# Altium schematic sheet Top-level.SchDoc: =Project + Document
size A4; SheetNumber: 1; SheetTotal: SheetTotaal; Document: Top-level
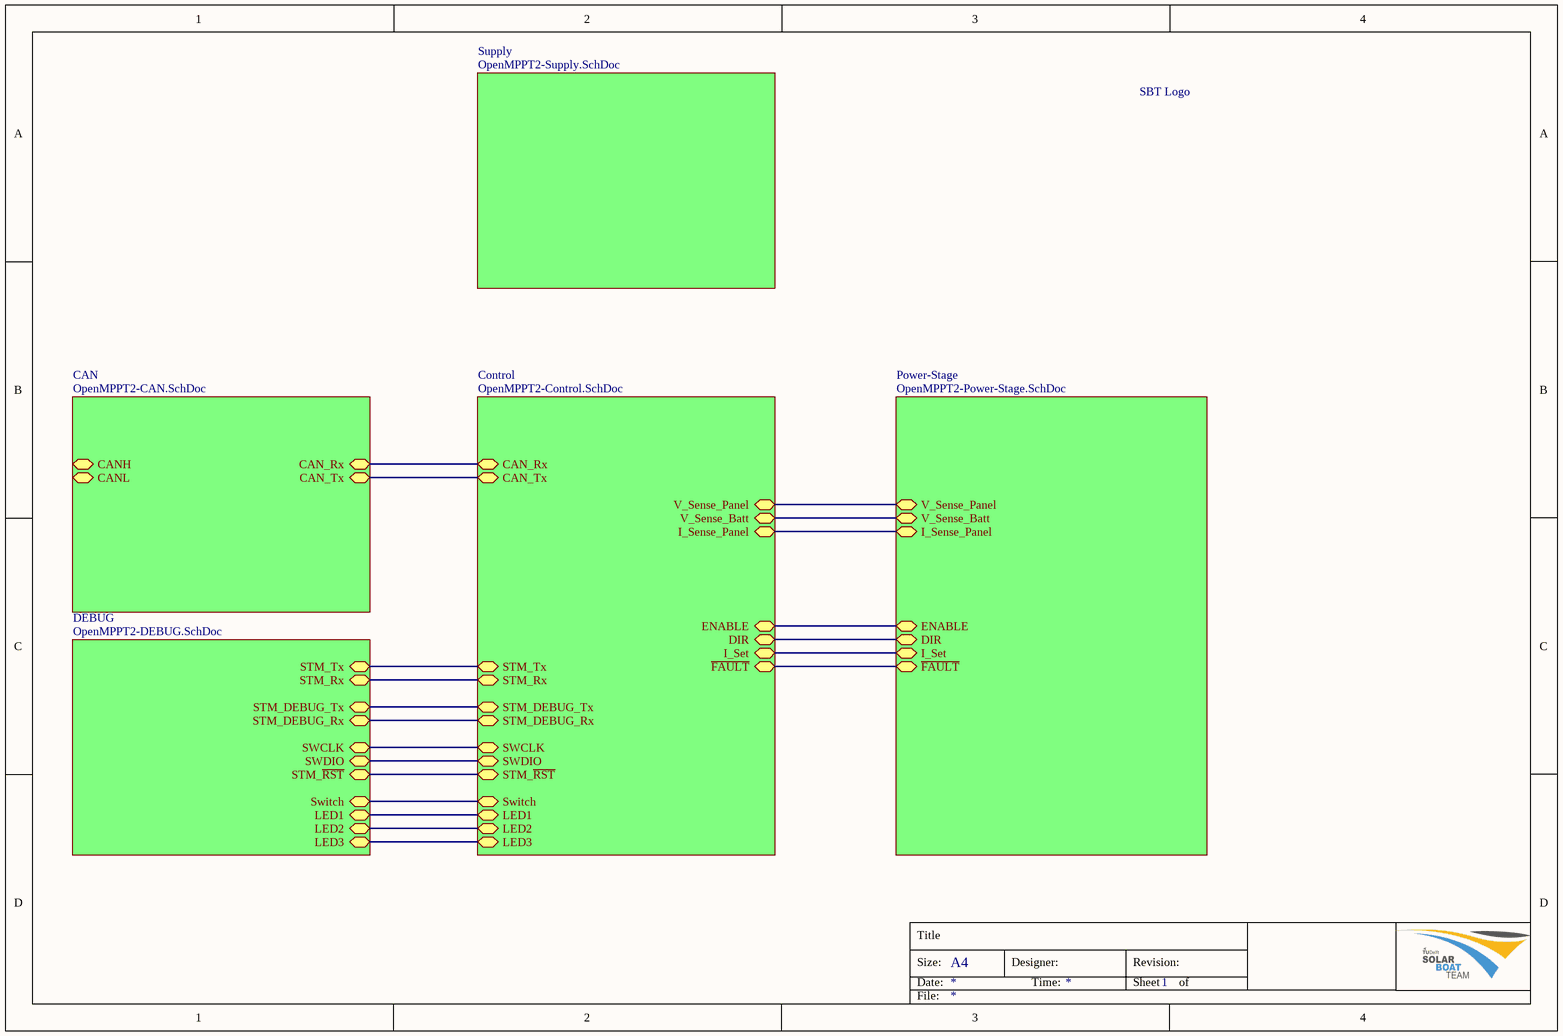
[diagram p0: Top-level.SchDoc]

## Parts
Logo1  SBT Logo  [SBT Logo 1000x]  (value not drawn)

## Sub-sheets
CAN = OpenMPPT2-CAN.SchDoc: CAN_Rx, CAN_Tx, CANH, CANL
Control = OpenMPPT2-Control.SchDoc: STM_~{RST}, SWCLK, SWDIO, STM_Rx, STM_Tx, STM_DEBUG_Rx, STM_DEBUG_Tx, CAN_Rx, CAN_Tx, LED1, LED2, Switch, V_Sense_Panel, I_Set, V_Sense_Batt, I_Sense_Panel, ENABLE, DIR, ~{FAULT}, LED3
DEBUG = OpenMPPT2-DEBUG.SchDoc: STM_~{RST}, SWCLK, SWDIO, STM_Rx, STM_Tx, STM_DEBUG_Tx, STM_DEBUG_Rx, LED1, LED2, Switch, LED3
Power-Stage = OpenMPPT2-Power-Stage.SchDoc: V_Sense_Panel, I_Set, V_Sense_Batt, I_Sense_Panel, ENABLE, DIR, ~{FAULT}
Supply = OpenMPPT2-Supply.SchDoc: no entries

## Nets
(unnamed): sheet Control/STM_~{RST}, sheet DEBUG/STM_~{RST}
(unnamed): sheet Control/SWCLK, sheet DEBUG/SWCLK
(unnamed): sheet Control/SWDIO, sheet DEBUG/SWDIO
(unnamed): sheet Control/STM_Rx, sheet DEBUG/STM_Rx
(unnamed): sheet Control/STM_Tx, sheet DEBUG/STM_Tx
(unnamed): sheet Control/STM_DEBUG_Rx, sheet DEBUG/STM_DEBUG_Rx
(unnamed): sheet Control/STM_DEBUG_Tx, sheet DEBUG/STM_DEBUG_Tx
(unnamed): sheet Control/CAN_Rx, sheet CAN/CAN_Rx
(unnamed): sheet Control/CAN_Tx, sheet CAN/CAN_Tx
(unnamed): sheet Control/LED1, sheet DEBUG/LED1
(unnamed): sheet Control/LED2, sheet DEBUG/LED2
(unnamed): sheet Control/Switch, sheet DEBUG/Switch
(unnamed): sheet Control/V_Sense_Panel, sheet Power-Stage/V_Sense_Panel
(unnamed): sheet Control/I_Set, sheet Power-Stage/I_Set
(unnamed): sheet Control/V_Sense_Batt, sheet Power-Stage/V_Sense_Batt
(unnamed): sheet Control/I_Sense_Panel, sheet Power-Stage/I_Sense_Panel
(unnamed): sheet Control/ENABLE, sheet Power-Stage/ENABLE
(unnamed): sheet Control/DIR, sheet Power-Stage/DIR
(unnamed): sheet Control/~{FAULT}, sheet Power-Stage/~{FAULT}
(unnamed): sheet Control/LED3, sheet DEBUG/LED3

## Notes on the sheet
- Title
- Size:
- Date:
- A4
- Designer:
- Time:
- Revision:
- Sheet
- of
- File:

## Library data of the parts
Logo1 = SBT Logo: B'vo